# Altium schematic sheet ETHERNET.SchDoc
size A1
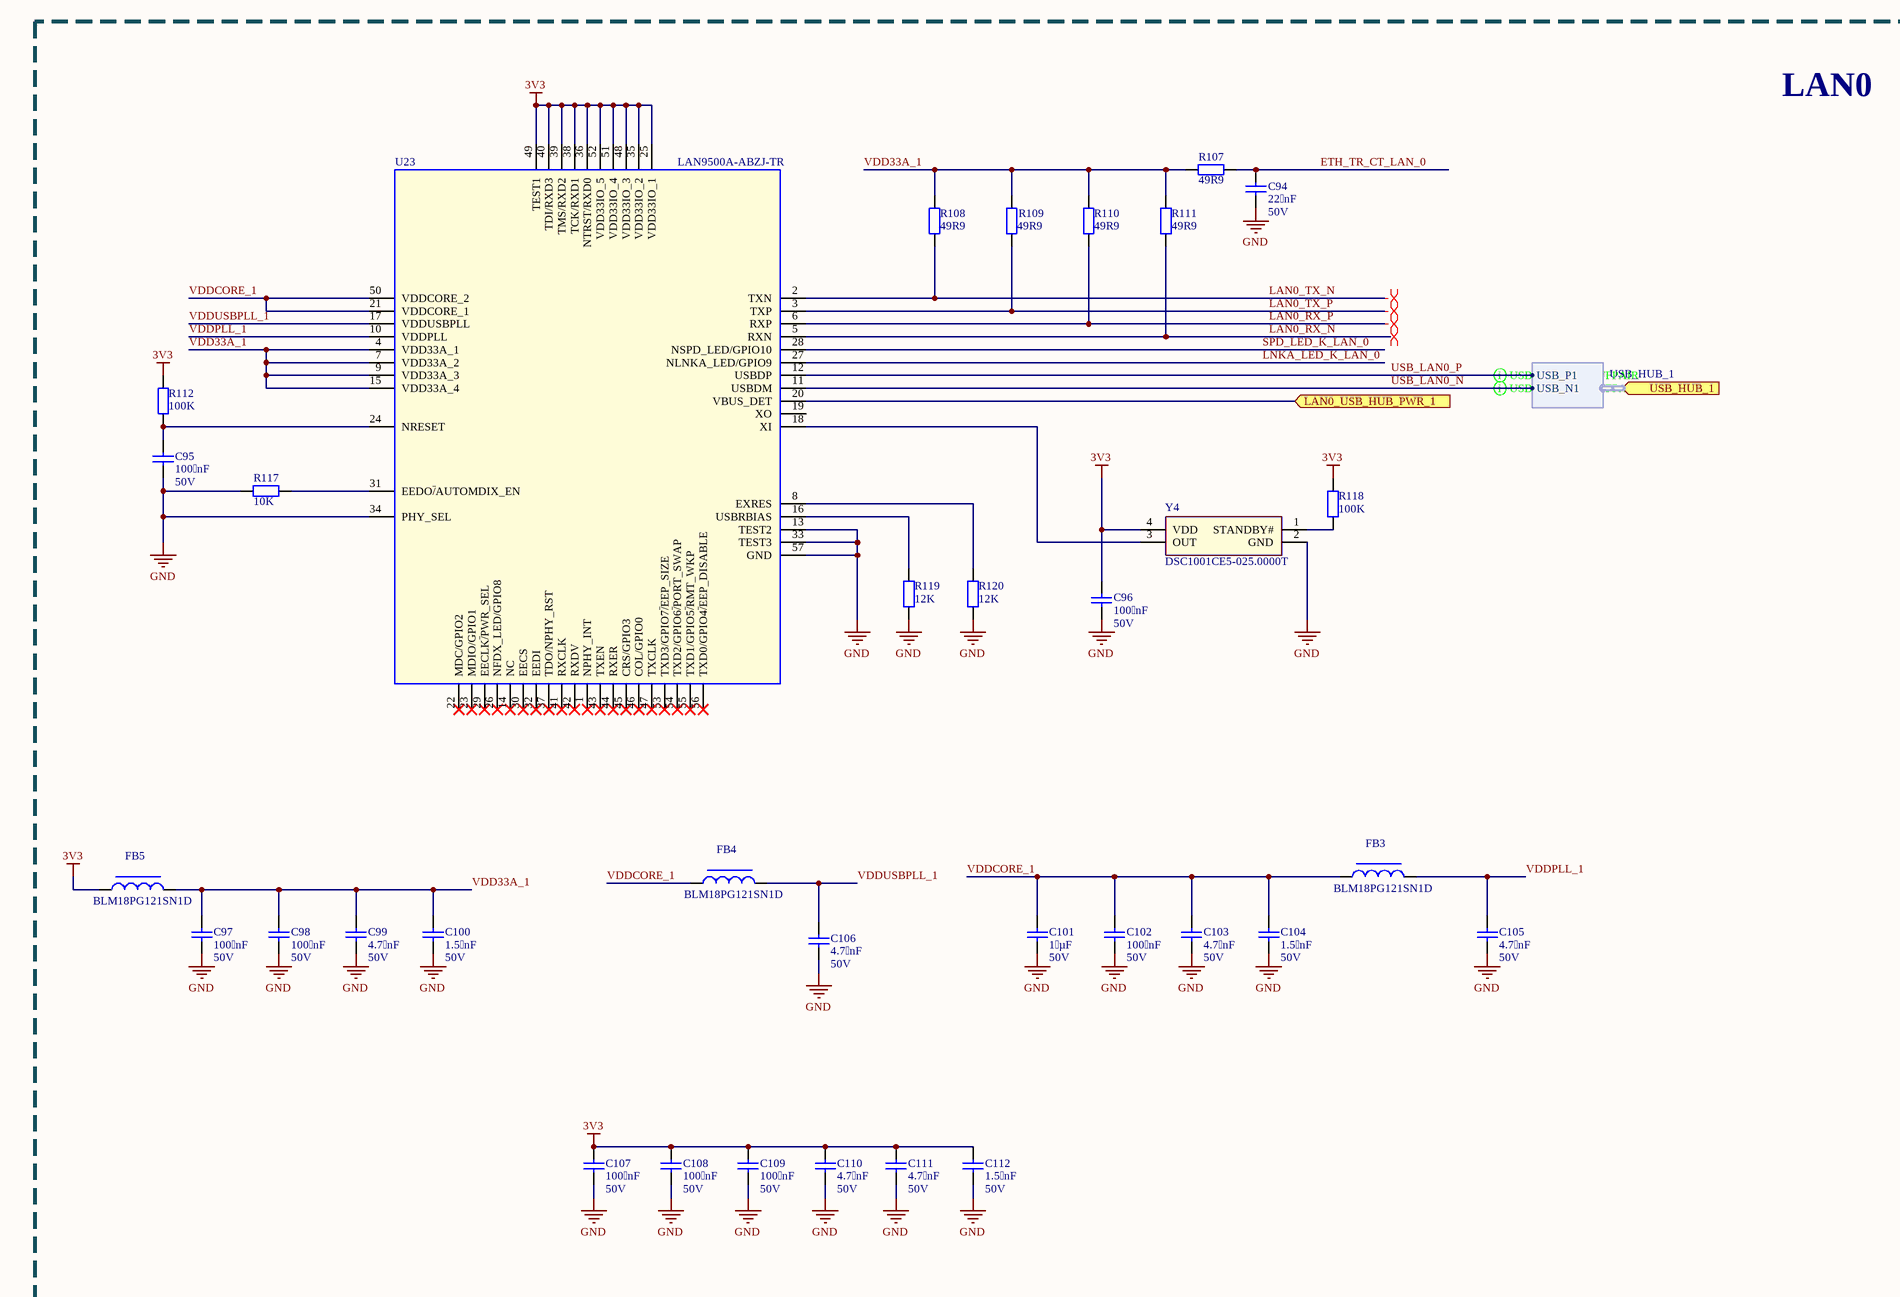
[diagram p0: ETHERNET.SchDoc, top left]
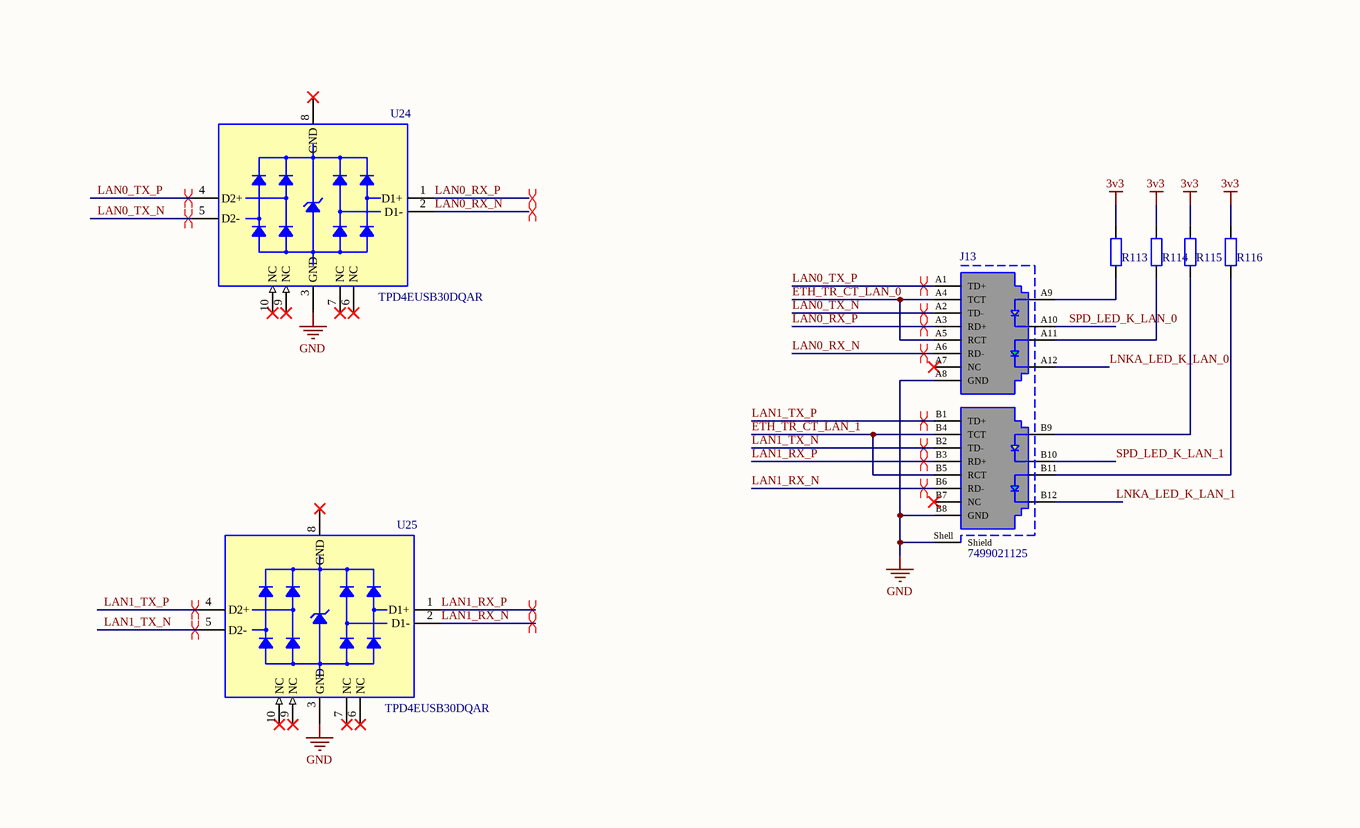
[diagram p1: ETHERNET.SchDoc, top right]
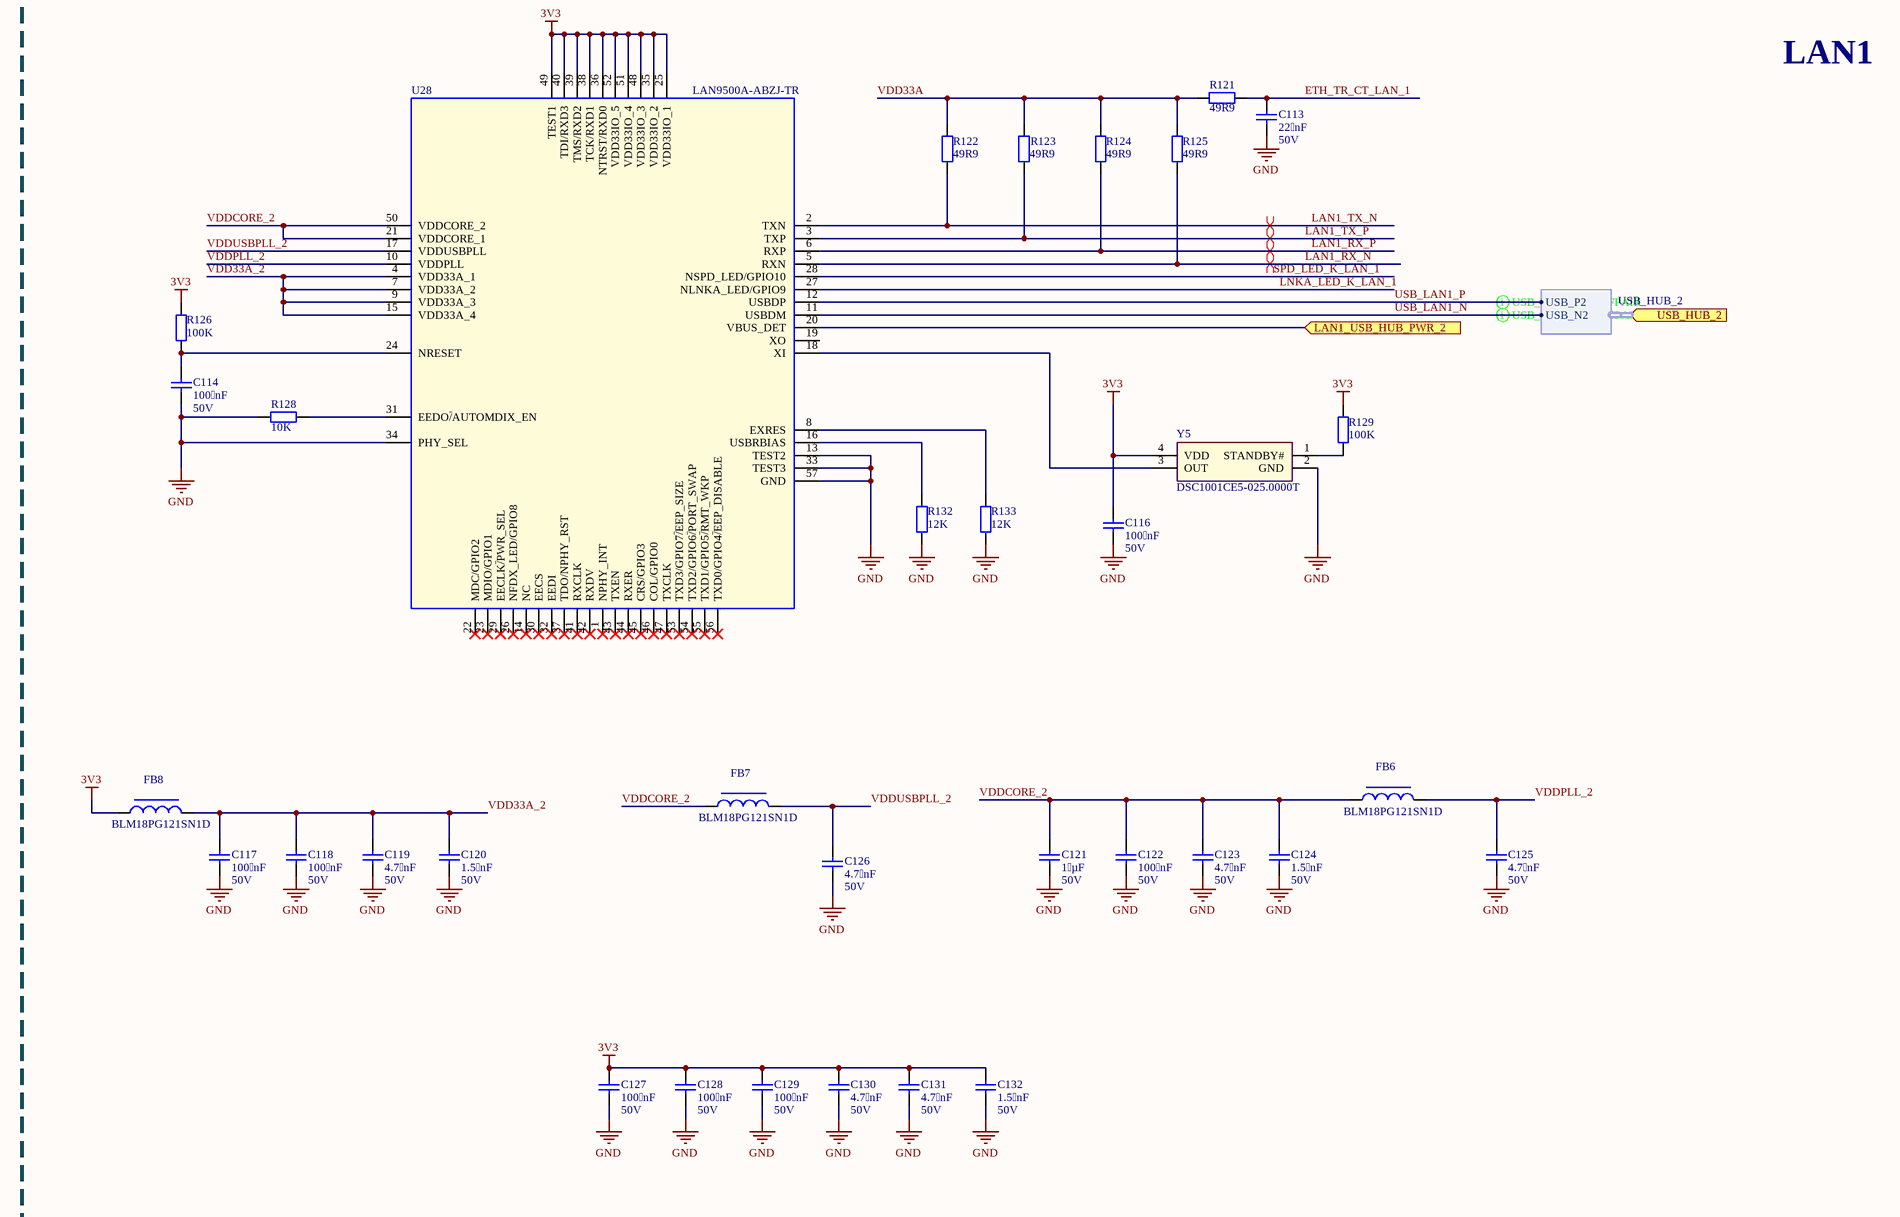
[diagram p2: ETHERNET.SchDoc, bottom left]
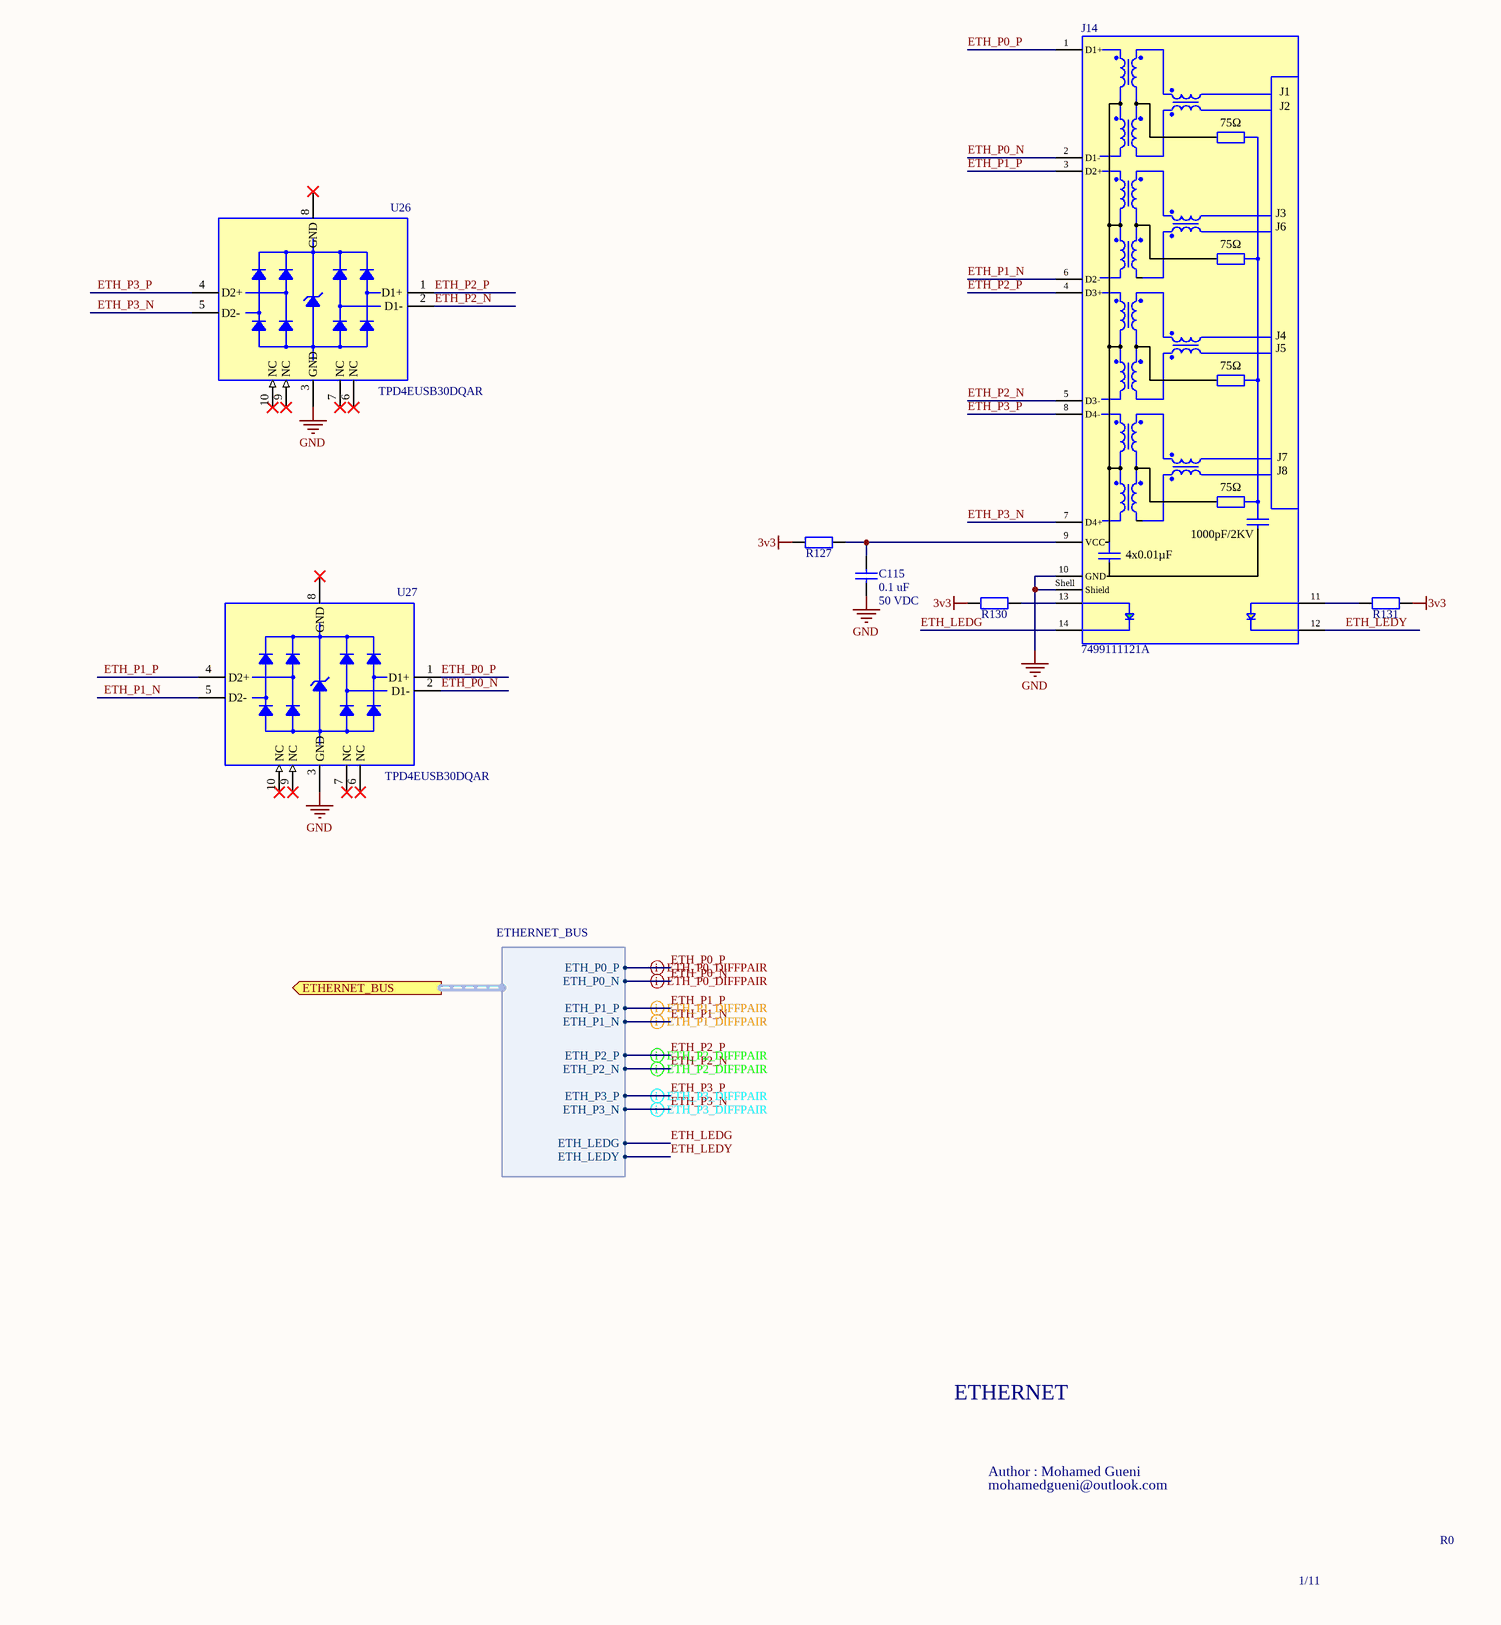
[diagram p3: ETHERNET.SchDoc, bottom right]

## Parts
C94  Value 1: 22 nF  Value 2: 50V  [CAPC1608N]  (hidden comment: GRM188R71H223KA01D)
C95  Value 1: 100 nF  Value 2: 50V  [CAPC1608N]  (hidden comment: GRM188R71H104KA93D)
C96  Value 1: 100 nF  Value 2: 50V  [CAPC1608N]  (hidden comment: GRM188R71H104KA93D)
C97  Value 1: 100 nF  Value 2: 50V  [CAPC1608N]  (hidden comment: GRM188R71H104KA93D)
C98  Value 1: 100 nF  Value 2: 50V  [CAPC1608N]  (hidden comment: GRM188R71H104KA93D)
C99  Value 1: 4.7 nF  Value 2: 50V  [CAPC1608N]  (hidden comment: GRM188R71H472KA01D)
C100  Value 1: 1.5 nF  Value 2: 50V  [CAPC1608N]  (hidden comment: GRM188R71H152KA01D)
C101  Value 1: 1 µF  Value 2: 50V  [CAPC1608N]  (hidden comment: GRM188R61H105KAALD)
C102  Value 1: 100 nF  Value 2: 50V  [CAPC1608N]  (hidden comment: GRM188R71H104KA93D)
C103  Value 1: 4.7 nF  Value 2: 50V  [CAPC1608N]  (hidden comment: GRM188R71H472KA01D)
C104  Value 1: 1.5 nF  Value 2: 50V  [CAPC1608N]  (hidden comment: GRM188R71H152KA01D)
C105  Value 1: 4.7 nF  Value 2: 50V  [CAPC1608N]  (hidden comment: GRM188R71H472KA01D)
C106  Value 1: 4.7 nF  Value 2: 50V  [CAPC1608N]  (hidden comment: GRM188R71H472KA01D)
C107  Value 1: 100 nF  Value 2: 50V  [CAPC1608N]  (hidden comment: GRM188R71H104KA93D)
C108  Value 1: 100 nF  Value 2: 50V  [CAPC1608N]  (hidden comment: GRM188R71H104KA93D)
C109  Value 1: 100 nF  Value 2: 50V  [CAPC1608N]  (hidden comment: GRM188R71H104KA93D)
C110  Value 1: 4.7 nF  Value 2: 50V  [CAPC1608N]  (hidden comment: GRM188R71H472KA01D)
C111  Value 1: 4.7 nF  Value 2: 50V  [CAPC1608N]  (hidden comment: GRM188R71H472KA01D)
C112  Value 1: 1.5 nF  Value 2: 50V  [CAPC1608N]  (hidden comment: GRM188R71H152KA01D)
C113  Value 1: 22 nF  Value 2: 50V  [CAPC1608N]  (hidden comment: GRM188R71H223KA01D)
C114  Value 1: 100 nF  Value 2: 50V  [CAPC1608N]  (hidden comment: GRM188R71H104KA93D)
C115  Value 1: 0.1 uF  Value 2: 50 VDC  [CAPC1608N]  (hidden comment: Capacitor)
C116  Value 1: 100 nF  Value 2: 50V  [CAPC1608N]  (hidden comment: GRM188R71H104KA93D)
C117  Value 1: 100 nF  Value 2: 50V  [CAPC1608N]  (hidden comment: GRM188R71H104KA93D)
C118  Value 1: 100 nF  Value 2: 50V  [CAPC1608N]  (hidden comment: GRM188R71H104KA93D)
C119  Value 1: 4.7 nF  Value 2: 50V  [CAPC1608N]  (hidden comment: GRM188R71H472KA01D)
C120  Value 1: 1.5 nF  Value 2: 50V  [CAPC1608N]  (hidden comment: GRM188R71H152KA01D)
C121  Value 1: 1 µF  Value 2: 50V  [CAPC1608N]  (hidden comment: GRM188R61H105KAALD)
C122  Value 1: 100 nF  Value 2: 50V  [CAPC1608N]  (hidden comment: GRM188R71H104KA93D)
C123  Value 1: 4.7 nF  Value 2: 50V  [CAPC1608N]  (hidden comment: GRM188R71H472KA01D)
C124  Value 1: 1.5 nF  Value 2: 50V  [CAPC1608N]  (hidden comment: GRM188R71H152KA01D)
C125  Value 1: 4.7 nF  Value 2: 50V  [CAPC1608N]  (hidden comment: GRM188R71H472KA01D)
C126  Value 1: 4.7 nF  Value 2: 50V  [CAPC1608N]  (hidden comment: GRM188R71H472KA01D)
C127  Value 1: 100 nF  Value 2: 50V  [CAPC1608N]  (hidden comment: GRM188R71H104KA93D)
C128  Value 1: 100 nF  Value 2: 50V  [CAPC1608N]  (hidden comment: GRM188R71H104KA93D)
C129  Value 1: 100 nF  Value 2: 50V  [CAPC1608N]  (hidden comment: GRM188R71H104KA93D)
C130  Value 1: 4.7 nF  Value 2: 50V  [CAPC1608N]  (hidden comment: GRM188R71H472KA01D)
C131  Value 1: 4.7 nF  Value 2: 50V  [CAPC1608N]  (hidden comment: GRM188R71H472KA01D)
C132  Value 1: 1.5 nF  Value 2: 50V  [CAPC1608N]  (hidden comment: GRM188R71H152KA01D)
FB3  BLM18PG121SN1D  [BLM18SP221SN1B]
FB4  BLM18PG121SN1D  [BLM18SP221SN1B]
FB5  BLM18PG121SN1D  [BLM18SP221SN1B]
FB6  BLM18PG121SN1D  [BLM18SP221SN1B]
FB7  BLM18PG121SN1D  [BLM18SP221SN1B]
FB8  BLM18PG121SN1D  [BLM18SP221SN1B]
J13  7499021125  [WE-RJ45-7499021125]
J14  7499111121A  [WE-RJ45-7499111121A]
R107  Value 1: 49R9  [RESC1608N]
R108  Value 1: 49R9  [RESC1608N]
R109  Value 1: 49R9  [RESC1608N]
R110  Value 1: 49R9  [RESC1608N]
R111  Value 1: 49R9  [RESC1608N]
R112  Value 1: 100K  [RESC1608N]  (hidden comment: RN731JTTD1003F100)
R113  Resistor  [RESC1608N]  (value not drawn)
R114  Resistor  [RESC1608N]  (value not drawn)
R115  Resistor  [RESC1608N]  (value not drawn)
R116  Resistor  [RESC1608N]  (value not drawn)
R117  Value 1: 10K  [RESC1608N]  (hidden comment: RN731JTTD1002F25)
R118  Value 1: 100K  [RESC1608N]  (hidden comment: RN731JTTD1003F100)
R119  Value 1: 12K  [RESC1608N]  (hidden comment: RN73H1JTTD1202F100)
R120  Value 1: 12K  [RESC1608N]  (hidden comment: RN73H1JTTD1202F100)
R121  Value 1: 49R9  [RESC1608N]
R122  Value 1: 49R9  [RESC1608N]
R123  Value 1: 49R9  [RESC1608N]
R124  Value 1: 49R9  [RESC1608N]
R125  Value 1: 49R9  [RESC1608N]
R126  Value 1: 100K  [RESC1608N]  (hidden comment: RN731JTTD1003F100)
R127  Resistor  [RESC1608N]  (value not drawn)
R128  Value 1: 10K  [RESC1608N]  (hidden comment: RN731JTTD1002F25)
R129  Value 1: 100K  [RESC1608N]  (hidden comment: RN731JTTD1003F100)
R130  Resistor  [RESC1608N]  (value not drawn)
R131  Resistor  [RESC1608N]  (value not drawn)
R132  Value 1: 12K  [RESC1608N]  (hidden comment: RN73H1JTTD1202F100)
R133  Value 1: 12K  [RESC1608N]  (hidden comment: RN73H1JTTD1202F100)
U23  LAN9500A-ABZJ-TR  [QFN50P800X800X100-57N-D]
U24  TPD4EUSB30DQAR  [USON-10]
U25  TPD4EUSB30DQAR  [USON-10]
U26  TPD4EUSB30DQAR  [USON-10]
U27  TPD4EUSB30DQAR  [USON-10]
U28  LAN9500A-ABZJ-TR  [QFN50P800X800X100-57N-D]
Y4  DSC1001CE5-025.0000T  [DSC6183CI2A032K768]
Y5  DSC1001CE5-025.0000T  [DSC6183CI2A032K768]

## Blocks framed on the sheet
LAN0: C94-C112 FB3-FB5 R107-R112 R117-R120 U23 Y4
LAN1: C113 C114 C116-C132 FB6-FB8 R121-R126 R128 R129 R132 R133 U28 Y5

## Ports
ETHERNET_BUS (out, harness ETHERNET_BUS), LAN0_USB_HUB_PWR_1 (in), LAN1_USB_HUB_PWR_2 (in), USB_HUB_1 (in, harness USB_HUB_1), USB_HUB_2 (in, harness USB_HUB_2)

## Harnesses
ETHERNET_BUS: ETH_P3_P, ETH_P3_N, ETH_P0_N, ETH_P0_P, ETH_P1_N, ETH_P1_P, ETH_P2_P, ETH_P2_N, ETH_LEDG, ETH_LEDY
USB_HUB_1: USB_N1, USB_P1
USB_HUB_2: USB_P2, USB_N2

## Nets
3V3: C96.2 C107.2 C108.2 C109.2 C110.2 C111.2 C112.2 C116.2 C127.2 C128.2 C129.2 C130.2 C131.2 C132.2 FB5.1 FB8.1 R112.2 R113.2 R114.2 R115.2 R116.2 R118.2 R126.2 R127.2 R129.2 R130.2 R131.2 U23.25(VDD33IO_1) U23.35(VDD33IO_2) U23.36(NTRST/RXD0) U23.38(TCK/RXD1) U23.39(TMS/RXD2) U23.40(TDI/RXD3) U23.48(VDD33IO_3) U23.49(TEST1) U23.51(VDD33IO_4) U23.52(VDD33IO_5) U28.25(VDD33IO_1) U28.35(VDD33IO_2) U28.36(NTRST/RXD0) U28.38(TCK/RXD1) U28.39(TMS/RXD2) U28.40(TDI/RXD3) U28.48(VDD33IO_3) U28.49(TEST1) U28.51(VDD33IO_4) U28.52(VDD33IO_5) Y4.4(VDD) Y5.4(VDD)
GND: C94.1 C95.1 C96.1 C97.1 C98.1 C99.1 C100.1 C101.1 C102.1 C103.1 C104.1 C105.1 C106.1 C107.1 C108.1 C109.1 C110.1 C111.1 C112.1 C113.1 C114.1 C115.1 C116.1 C117.1 C118.1 C119.1 C120.1 C121.1 C122.1 C123.1 C124.1 C125.1 C126.1 C127.1 C128.1 C129.1 C130.1 C131.1 C132.1 J13.A8(GND) J13.B8(GND) J13.Shell(Shield) J14.10(GND) J14.Shell(Shield) R117.2 R119.1 R120.1 R128.2 R132.1 R133.1 U23.13(TEST2) U23.33(TEST3) U23.34(PHY_SEL) U23.57(GND) U24.3(GND) U25.3(GND) U26.3(GND) U27.3(GND) U28.13(TEST2) U28.33(TEST3) U28.34(PHY_SEL) U28.57(GND) Y4.2(GND) Y5.2(GND)
ETH_LEDG: J14.14 ; port ETHERNET_BUS.ETH_LEDG
ETH_LEDY: J14.12 ; port ETHERNET_BUS.ETH_LEDY
ETH_P0_N: J14.2(D1-) U27.2(D1-) ; port ETHERNET_BUS.ETH_P0_N
ETH_P0_P: J14.1(D1+) U27.1(D1+) ; port ETHERNET_BUS.ETH_P0_P
ETH_P1_N: J14.6(D2-) U27.5(D2-) ; port ETHERNET_BUS.ETH_P1_N
ETH_P1_P: J14.3(D2+) U27.4(D2+) ; port ETHERNET_BUS.ETH_P1_P
ETH_P2_N: J14.5(D3-) U26.2(D1-) ; port ETHERNET_BUS.ETH_P2_N
ETH_P2_P: J14.4(D3+) U26.1(D1+) ; port ETHERNET_BUS.ETH_P2_P
ETH_P3_N: J14.7(D4+) U26.5(D2-) ; port ETHERNET_BUS.ETH_P3_N
ETH_P3_P: J14.8(D4-) U26.4(D2+) ; port ETHERNET_BUS.ETH_P3_P
ETH_TR_CT_LAN_0: C94.2 J13.A4(TCT) J13.A5(RCT) R107.1
ETH_TR_CT_LAN_1: C113.2 J13.B4(TCT) J13.B5(RCT) R121.1
LAN0_RX_N: J13.A6(RD-) R111.2 U23.5(RXN) U24.2(D1-)
LAN0_RX_P: J13.A3(RD+) R110.2 U23.6(RXP) U24.1(D1+)
LAN0_TX_N: J13.A2(TD-) R108.2 U23.2(TXN) U24.5(D2-)
LAN0_TX_P: J13.A1(TD+) R109.2 U23.3(TXP) U24.4(D2+)
LAN0_USB_HUB_PWR_1: U23.20(VBUS_DET) ; port LAN0_USB_HUB_PWR_1
LAN1_RX_N: J13.B6(RD-) R125.2 U25.2(D1-) U28.5(RXN)
LAN1_RX_P: J13.B3(RD+) R124.2 U25.1(D1+) U28.6(RXP)
LAN1_TX_N: J13.B2(TD-) R122.2 U25.5(D2-) U28.2(TXN)
LAN1_TX_P: J13.B1(TD+) R123.2 U25.4(D2+) U28.3(TXP)
LAN1_USB_HUB_PWR_2: U28.20(VBUS_DET) ; port LAN1_USB_HUB_PWR_2
LNKA_LED_K_LAN_0: J13.A12 U23.27(NLNKA_LED/GPIO9)
LNKA_LED_K_LAN_1: J13.B12 U28.27(NLNKA_LED/GPIO9)
SPD_LED_K_LAN_0: J13.A10 U23.28(NSPD_LED/GPIO10)
SPD_LED_K_LAN_1: J13.B10 U28.28(NSPD_LED/GPIO10)
USB_LAN0_N: U23.11(USBDM) ; port USB_HUB_1.USB_N1
USB_LAN0_P: U23.12(USBDP) ; port USB_HUB_1.USB_P1
USB_LAN1_N: U28.11(USBDM) ; port USB_HUB_2.USB_N2
USB_LAN1_P: U28.12(USBDP) ; port USB_HUB_2.USB_P2
VDD33A: R121.2 R122.1 R123.1 R124.1 R125.1
VDD33A_1: C97.2 C98.2 C99.2 C100.2 FB5.2 R107.2 R108.1 R109.1 R110.1 R111.1 U23.4(VDD33A_1) U23.7(VDD33A_2) U23.9(VDD33A_3) U23.15(VDD33A_4)
VDD33A_2: C117.2 C118.2 C119.2 C120.2 FB8.2 U28.4(VDD33A_1) U28.7(VDD33A_2) U28.9(VDD33A_3) U28.15(VDD33A_4)
VDDCORE_1: C101.2 C102.2 C103.2 C104.2 FB3.1 FB4.1 U23.21(VDDCORE_1) U23.50(VDDCORE_2)
VDDCORE_2: C121.2 C122.2 C123.2 C124.2 FB6.1 FB7.1 U28.21(VDDCORE_1) U28.50(VDDCORE_2)
VDDPLL_1: C105.2 FB3.2 U23.10(VDDPLL)
VDDPLL_2: C125.2 FB6.2 U28.10(VDDPLL)
VDDUSBPLL_1: C106.2 FB4.2 U23.17(VDDUSBPLL)
VDDUSBPLL_2: C126.2 FB7.2 U28.17(VDDUSBPLL)
NetC95_2: C95.2 R112.1 U23.24(NRESET)
NetC114_2: C114.2 R126.1 U28.24(NRESET)
NetC115_2: C115.2 J14.9(VCC) R127.1
NetJ13_A9: J13.A9 R113.1
NetJ13_A11: J13.A11 R114.1
NetJ13_B9: J13.B9 R115.1
NetJ13_B11: J13.B11 R116.1
NetJ14_11: J14.11 R131.1
NetJ14_13: J14.13 R130.1
NetR117_1: R117.1 U23.31(EEDO~{/}AUTOMDIX_EN)
NetR118_1: R118.1 Y4.1(STANDBY#)
NetR119_2: R119.2 U23.16(USBRBIAS)
NetR120_2: R120.2 U23.8(EXRES)
NetR128_1: R128.1 U28.31(EEDO~{/}AUTOMDIX_EN)
NetR129_1: R129.1 Y5.1(STANDBY#)
NetR132_2: R132.2 U28.16(USBRBIAS)
NetR133_2: R133.2 U28.8(EXRES)
NetU23_18: U23.18(XI) Y4.3(OUT)
NetU28_18: U28.18(XI) Y5.3(OUT)

Not connected (* = marked no-connect by the designer): J13 A7(NC)* B7(NC)*; U23 1(NPHY_INT)* 14(NC)* 19(XO) 22(MDC/GPIO2)* 23(MDIO/GPIO1)* 26(NFDX_LED/GPIO8)* 29(EECLK~{/}PWR_SEL)* 30(EECS)* 32(EEDI)* 37(TDO/NPHY_RST)* 41(RXCLK)* 42(RXDV)* 43(TXEN)* 44(RXER)* 45(CRS/GPIO3)* 46(COL/GPIO0)* 47(TXCLK)* 53(TXD3/GPIO7~{/}EEP_SIZE)* 54(TXD2/GPIO6~{/}PORT_SWAP)* 55(TXD1/GPIO5~{/}RMT_WKP)* 56(TXD0/GPIO4~{/}EEP_DISABLE)*; U24 6(NC)* 7(NC)* 8(GND)* 9(NC)* 10(NC)*; U25 6(NC)* 7(NC)* 8(GND)* 9(NC)* 10(NC)*; U26 6(NC)* 7(NC)* 8(GND)* 9(NC)* 10(NC)*; U27 6(NC)* 7(NC)* 8(GND)* 9(NC)* 10(NC)*; U28 1(NPHY_INT)* 14(NC)* 19(XO) 22(MDC/GPIO2)* 23(MDIO/GPIO1)* 26(NFDX_LED/GPIO8)* 29(EECLK~{/}PWR_SEL)* 30(EECS)* 32(EEDI)* 37(TDO/NPHY_RST)* 41(RXCLK)* 42(RXDV)* 43(TXEN)* 44(RXER)* 45(CRS/GPIO3)* 46(COL/GPIO0)* 47(TXCLK)* 53(TXD3/GPIO7~{/}EEP_SIZE)* 54(TXD2/GPIO6~{/}PORT_SWAP)* 55(TXD1/GPIO5~{/}RMT_WKP)* 56(TXD0/GPIO4~{/}EEP_DISABLE)*

## Layout directives
differential pair; differential pair class ETH_P0_DIFFPAIR: ETH_P0_N, ETH_P0_P
differential pair; differential pair class ETH_P1_DIFFPAIR: ETH_P1_N, ETH_P1_P
differential pair; differential pair class ETH_P2_DIFFPAIR: ETH_P2_N, ETH_P2_P
differential pair; differential pair class ETH_P3_DIFFPAIR: ETH_P3_N, ETH_P3_P
differential pair: LAN0_RX_N, LAN0_RX_P, LAN0_TX_N, LAN0_TX_P, LAN1_RX_N, LAN1_RX_P, LAN1_TX_N, LAN1_TX_P
differential pair; differential pair class USB_P_LAN0_DIFFPAIR: USB_LAN0_N, USB_LAN0_P
differential pair; differential pair class USB_P_LAN1_DIFFPAIR: USB_LAN1_N, USB_LAN1_P

## Notes on the sheet
- ETHERNET
- Author : Mohamed Gueni
- mohamedgueni@outlook.com
- 1/11
- R0
- (in symbol CON-000000002) J1; J2; 75Ω; J3; J6; J4; J5; J7; J8; 1000pF/2KV; 4x0.01µF

## Library data of the parts
C94 C113 = CAP-000000023: MAN: Murata; DES: Ceramic Capacitor, 22 nF, 50V, X7R, 0603; FTP: 603; SUPREF: 81-GRM188R71H223KA01D; Part Number: CAP-000000023; MANREF: GRM188R71H223KA01D
C95-C98 C102 C107-C109 C114 C116-C118 C122 C127-C129 = CAP-000000017: MAN: Murata; DES: Ceramic Capacitor, 100 nF, 50V, X7R, 0603; FTP: 603; SUPREF: 81-GRM188R71H104KA93D; Part Number: CAP-000000017; MANREF: GRM188R71H104KA93D
C99 C103 C105 C106 C110 C111 C119 C123 C125 C126 C130 C131 = CAP-000000019: MAN: Murata; DES: Ceramic Capacitor, 4.7 nF, 50V, X7R, 0603; FTP: 603; SUPREF: 81-GRM188R71H472KA01D; Part Number: CAP-000000019; MANREF: GRM188R71H472KA01D
C100 C104 C112 C120 C124 C132 = CAP-000000020: MAN: Murata; DES: Ceramic Capacitor, 1.5 nF, 50V, X7R, 0603; FTP: 603; SUPREF: 81-GRM188R71H152KA01D; Part Number: CAP-000000020; MANREF: GRM188R71H152KA01D
C101 C121 = CAP-000000018: MAN: Murata; DES: Ceramic Capacitor, 1 µF, 50V, X5R, 0603; FTP: 603; SUPREF: 81-GRM188R61H105KAALD; Part Number: CAP-000000018; MANREF: GRM188R61H105KAALD
C115 = CAP-000000003: MAN: KEMET; MANREF: C0603C104M5RAC; DES: Multilayer Ceramic Capacitors MLCC - SMD/SMT 50V 0.1uF 0603 X7R 20%; TOL: 20 %; FTP: 0603; SUP: Mouser; SUPREF: 80-C0603C104M5RAC; NOTE: _; Part Number: CAP-000000003
FB3-FB8 = F-000000001: MAN: Murata Electronics; DES: Ferrite Beads 120 OHM 25% Alternate Sizing Guide Below; Value 1: 120 Ohms; Value 2: 2 A; TOL: 25 %; FTP: F0603; SUP: Mouser; SUPREF: 81-BLM18PG121SN1D; NOTE: _; Part Number: F-000000001; MANREF: BLM18PG121SN1D
J13 = CON-000000008: MAN: Wurth Elektronik; DES: Modular Connectors / Ethernet Connectors WE-RJ45 Intgtd XFMR 1x2 THT Tab Down EMI; Value 1: _; Value 2: 10/100BaseT; FTP: THT; SUP: Mouser; SUPREF: 710-7499021125; Part Number: CON-000000008; MANREF: 7499021125; TOL: _; NOTE: _
J14 = CON-000000002: MAN: Wurth Elektronik; DES: Modular Connectors / Ethernet Connectors WE-RJ45 Intgtd XFMR 1x1 THT Tab Down EMI; Value 1: _; Value 2: 10/100/1000BaseT; FTP: THT; SUP: Mouser; SUPREF: 710-7499111121A; Part Number: CON-000000002; MANREF: 7499111121A; TOL: _; NOTE: _
R107-R111 R121-R125 = RES-0000000010: TOL: 1%; SUP: Mouser; NOTE: _; Part Number: RES-0000000010
R112 R118 R126 R129 = RES-000000002: MAN: KOA Speer; DES: Thin Film Resistors - SMD 0603 100 Kohms 1% 10PPM; Value 2: 0.63W; TOL: 1%; FTP: 0603; SUP: Mouser; SUPREF: 660-RN731JTD1003F100; NOTE: _; Part Number: RES-000000002; MANREF: RN731JTTD1003F100
R113-R116 R127 R130 R131 = RES-000000008: MAN: KOA Speer; Value 1: 330R; SUP: Mouser; NOTE: _; Part Number: RES-000000008
R117 R128 = RES-000000007: MAN: KOA Speer; DES: Thin Film Resistors - SMD 10kOhm,0603,1%,25ppm ,63mW,50V; Value 2: 0.63W; TOL: 1%; FTP: 0603; SUP: Mouser; SUPREF: 660-RN731JTTD1002F25; NOTE: _; Part Number: RES-000000007; MANREF: RN731JTTD1002F25
R119 R120 R132 R133 = RES-000000004: MAN: KOA Speer; DES: Thin Film Resistors - SMD 12kOhm,0603,1%,10ppm ,100mW,75V; Value 2: 0.1W; TOL: 1%; FTP: 0603; SUP: Mouser; SUPREF: 660-RN73H1JT1202F100; NOTE: _; Part Number: RES-000000004; MANREF: RN73H1JTTD1202F100
U23 U28 = GIC-000000010: MAN: Microchip Technology; DES: USB Interface IC Hi-Speed USB 2.0 10/100/1000 Ethernet; Value 1: 3.3 V; Value 2: 480 Mb/s; TOL: _; FTP: QFN-56; SUP: Mouser; SUPREF: 886-LAN9500A-ABZJ-TR; Part Number: GIC-000000010; MANREF: LAN9500A-ABZJ-TR; NOTE: _
U24-U27 = TVS-000000001: MAN: Texas Instruments; DES: ESD Suppressors / TVS Diodes 4Ch ESD SOLUTION; Value 1: 7 V; Value 2: 0.05 pF; TOL: _; SUP: Mouser; SUPREF: 595-TPD4EUSB30DQAR; Part Number: TVS-000000001; MANREF: TPD4EUSB30DQAR; FTP: USON-10; NOTE: _
Y4 Y5 = Y-000000001: MAN: Microchip Technology; DES: Standard Clock Oscillators MEMS Oscillator Low PWR LVCMOS -20C-70C; Value 1: 40 pF; Value 2: 25 MHz; TOL: 10 PPM; FTP: CDFN-4; SUP: Mouser; SUPREF: 579-001CE50250000T; NOTE: _; Part Number: Y-000000001; MANREF: DSC1001CE5-025.0000T